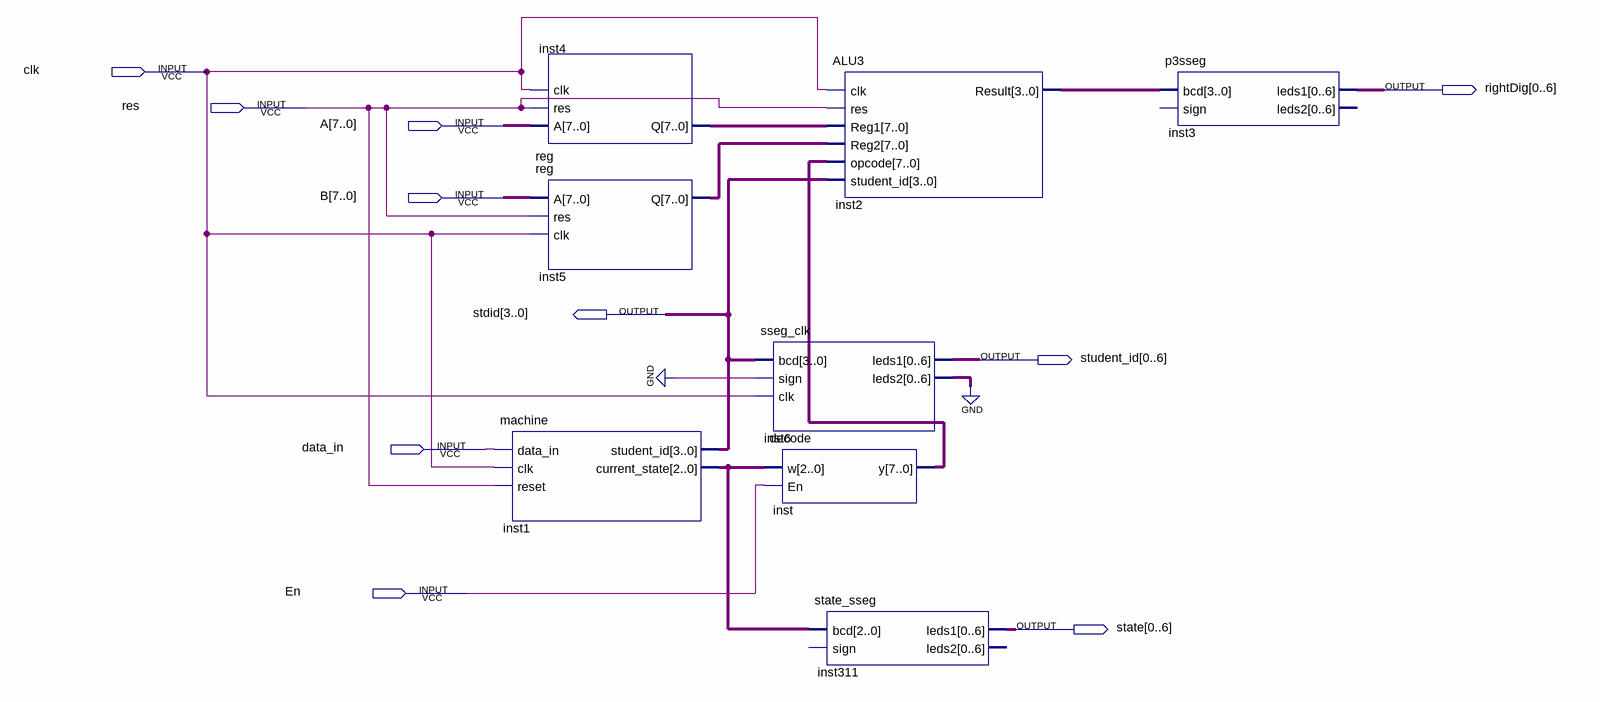
[diagram p0: schematic sheet]
// Quartus schematic p3CPU.bdf as structural Verilog: 8 symbols, 10 pins
module p3CPU (
  input  clk,
  input  res,
  input  [7:0] A,
  input  [7:0] B,
  input  data_in,
  input  En,
  output [0:6] rightDig,
  output [3:0] stdid,
  output [0:6] student_id,
  output [0:6] state
);

  wire [2:0] inst1_current_state;
  wire [3:0] inst2_result;
  wire [6:0] inst6_leds2;
  wire [7:0] inst4_q, inst5_q, inst_y;

  machine inst1 (.data_in(data_in), .clk(clk), .reset(res), .student_id(stdid), .current_state(inst1_current_state));
  \reg  inst4 (.A(A), .res(res), .clk(clk), .Q(inst4_q));
  \reg  inst5 (.A(B), .res(res), .clk(clk), .Q(inst5_q));
  sseg_clk inst6 (.bcd(stdid), .sign(1'b0), .clk(clk), .leds1(student_id), .leds2(inst6_leds2));
  decode inst (.w(inst1_current_state), .En(En), .y(inst_y));
  state_sseg inst311 (.bcd(inst1_current_state), .leds1(state));  // open: sign, leds2
  ALU3 inst2 (
    .clk(clk), .res(res), .Reg1(inst4_q), .Reg2(inst5_q), .opcode(inst_y), .student_id(stdid),
    .Result(inst2_result));
  p3sseg inst3 (.bcd(inst2_result), .leds1(rightDig));  // open: sign, leds2
  // also tied to GND on the sheet: {inst6_leds2[0], inst6_leds2[1], inst6_leds2[2], inst6_leds2[3], inst6_leds2[4], inst6_leds2[5], inst6_leds2[6]}
endmodule
